# Altium schematic sheet UI.SchDoc
size A
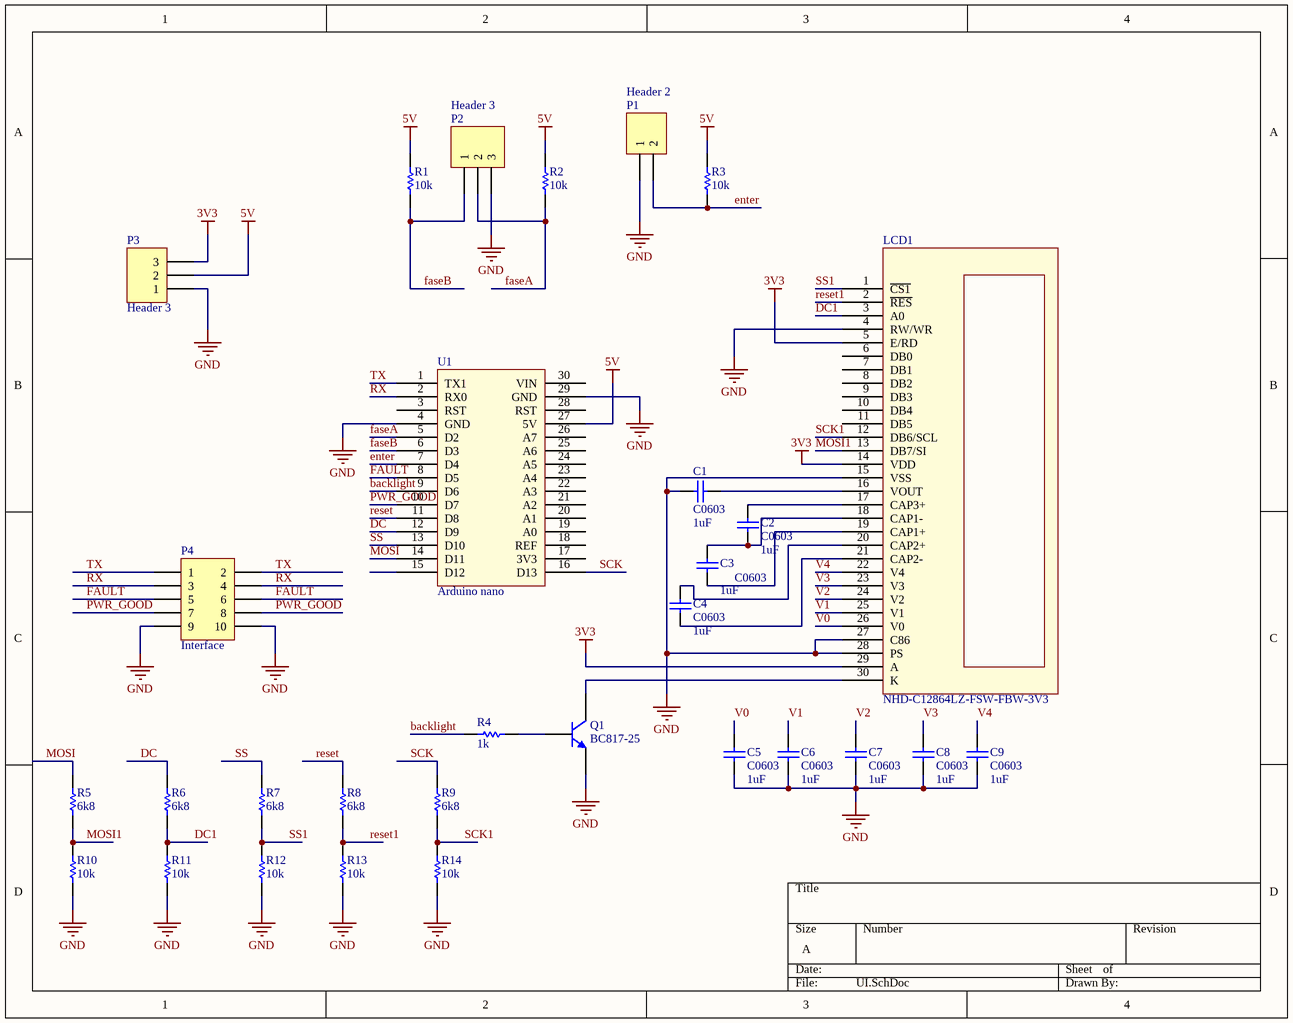
[diagram p0: UI.SchDoc]

## Parts
C1  C0603  value 1uF  [0603]
C2  C0603  value 1uF  [0603]
C3  C0603  value 1uF  [0603]
C4  C0603  value 1uF  [0603]
C5  C0603  value 1uF  [0603]
C6  C0603  value 1uF  [0603]
C7  C0603  value 1uF  [0603]
C8  C0603  value 1uF  [0603]
C9  C0603  value 1uF  [0603]
LCD1  NHD-C12864LZ-FSW-FBW-3V3  [NHD-C12864LZ-FSW-FBW-3V3]
P1  Header 2  [HDR1X2]
P2  Header 3  [HDR1X3]
P3  Header 3  [HDR1X3]
P4  Interface  [HDR2X5]
Q1  BC817-25  [SOT-23A_N]
R1  value 10k  [8RB-1206]  (hidden comment: SMD)
R2  value 10k  [8RB-1206]  (hidden comment: SMD)
R3  value 10k  [8RB-1206]  (hidden comment: SMD)
R4  value 1k  [8RB-1206]  (hidden comment: SMD)
R5  value 6k8  [8RB-1206]  (hidden comment: SMD)
R6  value 6k8  [8RB-1206]  (hidden comment: SMD)
R7  value 6k8  [8RB-1206]  (hidden comment: SMD)
R8  value 6k8  [8RB-1206]  (hidden comment: SMD)
R9  value 6k8  [8RB-1206]  (hidden comment: SMD)
R10  value 10k  [8RB-1206]  (hidden comment: SMD)
R11  value 10k  [8RB-1206]  (hidden comment: SMD)
R12  value 10k  [8RB-1206]  (hidden comment: SMD)
R13  value 10k  [8RB-1206]  (hidden comment: SMD)
R14  value 10k  [8RB-1206]  (hidden comment: SMD)
U1  Arduino nano  [ARDUINO NANO]

## Nets
3V3: LCD1.5(E/RD) LCD1.14(VDD) LCD1.29(A) P3.3
5V: P3.2 R1.2 R2.2 R3.2 U1.27(5V)
GND: C1.2 C5.1 C6.1 C7.1 C8.1 C9.1 LCD1.4(RW/WR) LCD1.15(VSS) LCD1.27(C86) LCD1.28(PS) P1.1 P2.3 P3.1 P4.9 P4.10 Q1.2(E) R10.1 R11.1 R12.1 R13.1 R14.1 U1.4(GND) U1.29(GND)
backlight: R4.2 U1.9(D6)
DC: R6.2 U1.12(D9)
DC1: LCD1.3(A0) R6.1 R11.2
enter: P1.2 R3.1 U1.7(D4)
faseA: P2.2 R2.1 U1.5(D2)
faseB: P2.1 R1.1 U1.6(D3)
FAULT: P4.5 P4.6 U1.8(D5)
MOSI: R5.2 U1.14(D11)
MOSI1: LCD1.13(DB7/SI) R5.1 R10.2
PWR_GOOD: P4.7 P4.8 U1.10(D7)
reset: R8.2 U1.11(D8)
reset1: LCD1.2(~{RES}) R8.1 R13.2
RX: P4.3 P4.4 U1.2(RX0)
SCK: R9.2 U1.16(D13)
SCK1: LCD1.12(DB6/SCL) R9.1 R14.2
SS: R7.2 U1.13(D10)
SS1: LCD1.1(~{CS1}) R7.1 R12.2
TX: P4.1 P4.2 U1.1(TX1)
V0: C5.2 LCD1.26(V0)
V1: C6.2 LCD1.25(V1)
V2: C7.2 LCD1.24(V2)
V3: C8.2 LCD1.23(V3)
V4: C9.2 LCD1.22(V4)
NetC1_1: C1.1 LCD1.16(VOUT)
NetC2_1: C2.1 C3.2 LCD1.18(CAP1-)
NetC2_2: C2.2 LCD1.17(CAP3+)
NetC3_1: C3.1 LCD1.19(CAP1+)
NetC4_1: C4.1 LCD1.21(CAP2-)
NetC4_2: C4.2 LCD1.20(CAP2+)
NetLCD1_30: LCD1.30(K) Q1.3(C)
NetQ1_1: Q1.1(B) R4.1

Not connected (* = marked no-connect by the designer): LCD1 6(DB0) 7(DB1) 8(DB2) 9(DB3) 10(DB4) 11(DB5); U1 3(RST) 15(D12) 17(3V3) 18(REF) 19(A0) 20(A1) 21(A2) 22(A3) 23(A4) 24(A5) 25(A6) 26(A7) 28(RST) 30(VIN)

## Library data of the parts
C1-C9 = C0603: C1608X7R1C105K X7R; Note: Footprint corresponds to dimensions for bulk cassette packaging. This case size has tightened tolerances.; Published: 17-Jul-2002; LatestRevisionDate: 19-Mar-2004; LatestRevisionNote: Silkscreen size reduced.; DatasheetDocument: Mar-2001; PackageDocument: Mar-2001; PackageReference: 0603; Publisher: Altium Limited; Code_JEITA: 0603; Code_IPC: 1608 [0603]; ComponentLink1Description: Manufacturer Link; ComponentLink1URL: http://www.kemet.com/; ComponentLink2Description: Datasheet; ComponentLink2URL: http://www.kemet.com/kemet/web/homepage/kechome.nsf/vapubfilesname/F3102TA.pdf/$file/F3102TA.pdf
P1 = Header 2: Header, 2-Pin; LatestRevisionDate: 17-Jul-2002; LatestRevisionNote: Re-released for DXP Platform.; Publisher: Altium Limited
P2 P3 = Header 3: Header, 3-Pin; LatestRevisionDate: 17-Jul-2002; LatestRevisionNote: Re-released for DXP Platform.; Publisher: Altium Limited
P4 = Header 5X2: Header, 5-Pin, Dual row; LatestRevisionDate: 17-Jul-2002; LatestRevisionNote: Re-released for DXP Platform.; Publisher: Altium Limited
Q1 = BC817-25: NPN General Purpose Amplifier; Published: 8-Jun-2000; LatestRevisionDate: 20-Nov-2009; LatestRevisionNote: IPC-7351 Footprint Added.; DatasheetVersion: 1997; PackageVersion: Sep-1998; PackageReference: SOT-23A; Publisher: Altium Limited; PackageDescription: 3-Pin SOT-23 Package 0.95 mm Pitch, 2.3 mm Lead Span; ComponentLink1Description: Manufacturer Link; ComponentLink1URL: http://www.fairchildsemi.com/; ComponentLink2Description: Discontinuation Notice; ComponentLink2URL: http://www.fairchildsemi.com/obsolete/obs.jsp
R1-R14 = ERJ8BQ: Low Ohmic Value Thick Film Chip Resistor, 0.22 Ohm to 9.1 Ohm Range, 1%, 2% and 5% Tolerance, 1206 Size, 0.33 W; Published: 17-Dec-2003; LatestRevisionDate: 19-Mar-2004; LatestRevisionNote: Silkscreen size reduced.; PackageDocument: Mar-2003; PackageReference: 8RB-1206; Publisher: Altium Limited; Code_IPC: 3216 [1206]; ComponentLink1Description: Manufacturer Link; ComponentLink1URL: http://www.panasonic.com/industrial/components/resistive_products.htm; ComponentLink2Description: Datasheet; ComponentLink2URL: http://www.panasonic.com/industrial/components/pdf/AOA0000CE3.pdf